# EAGLE schematic UAVpcb (EAGLE 9.6.2)
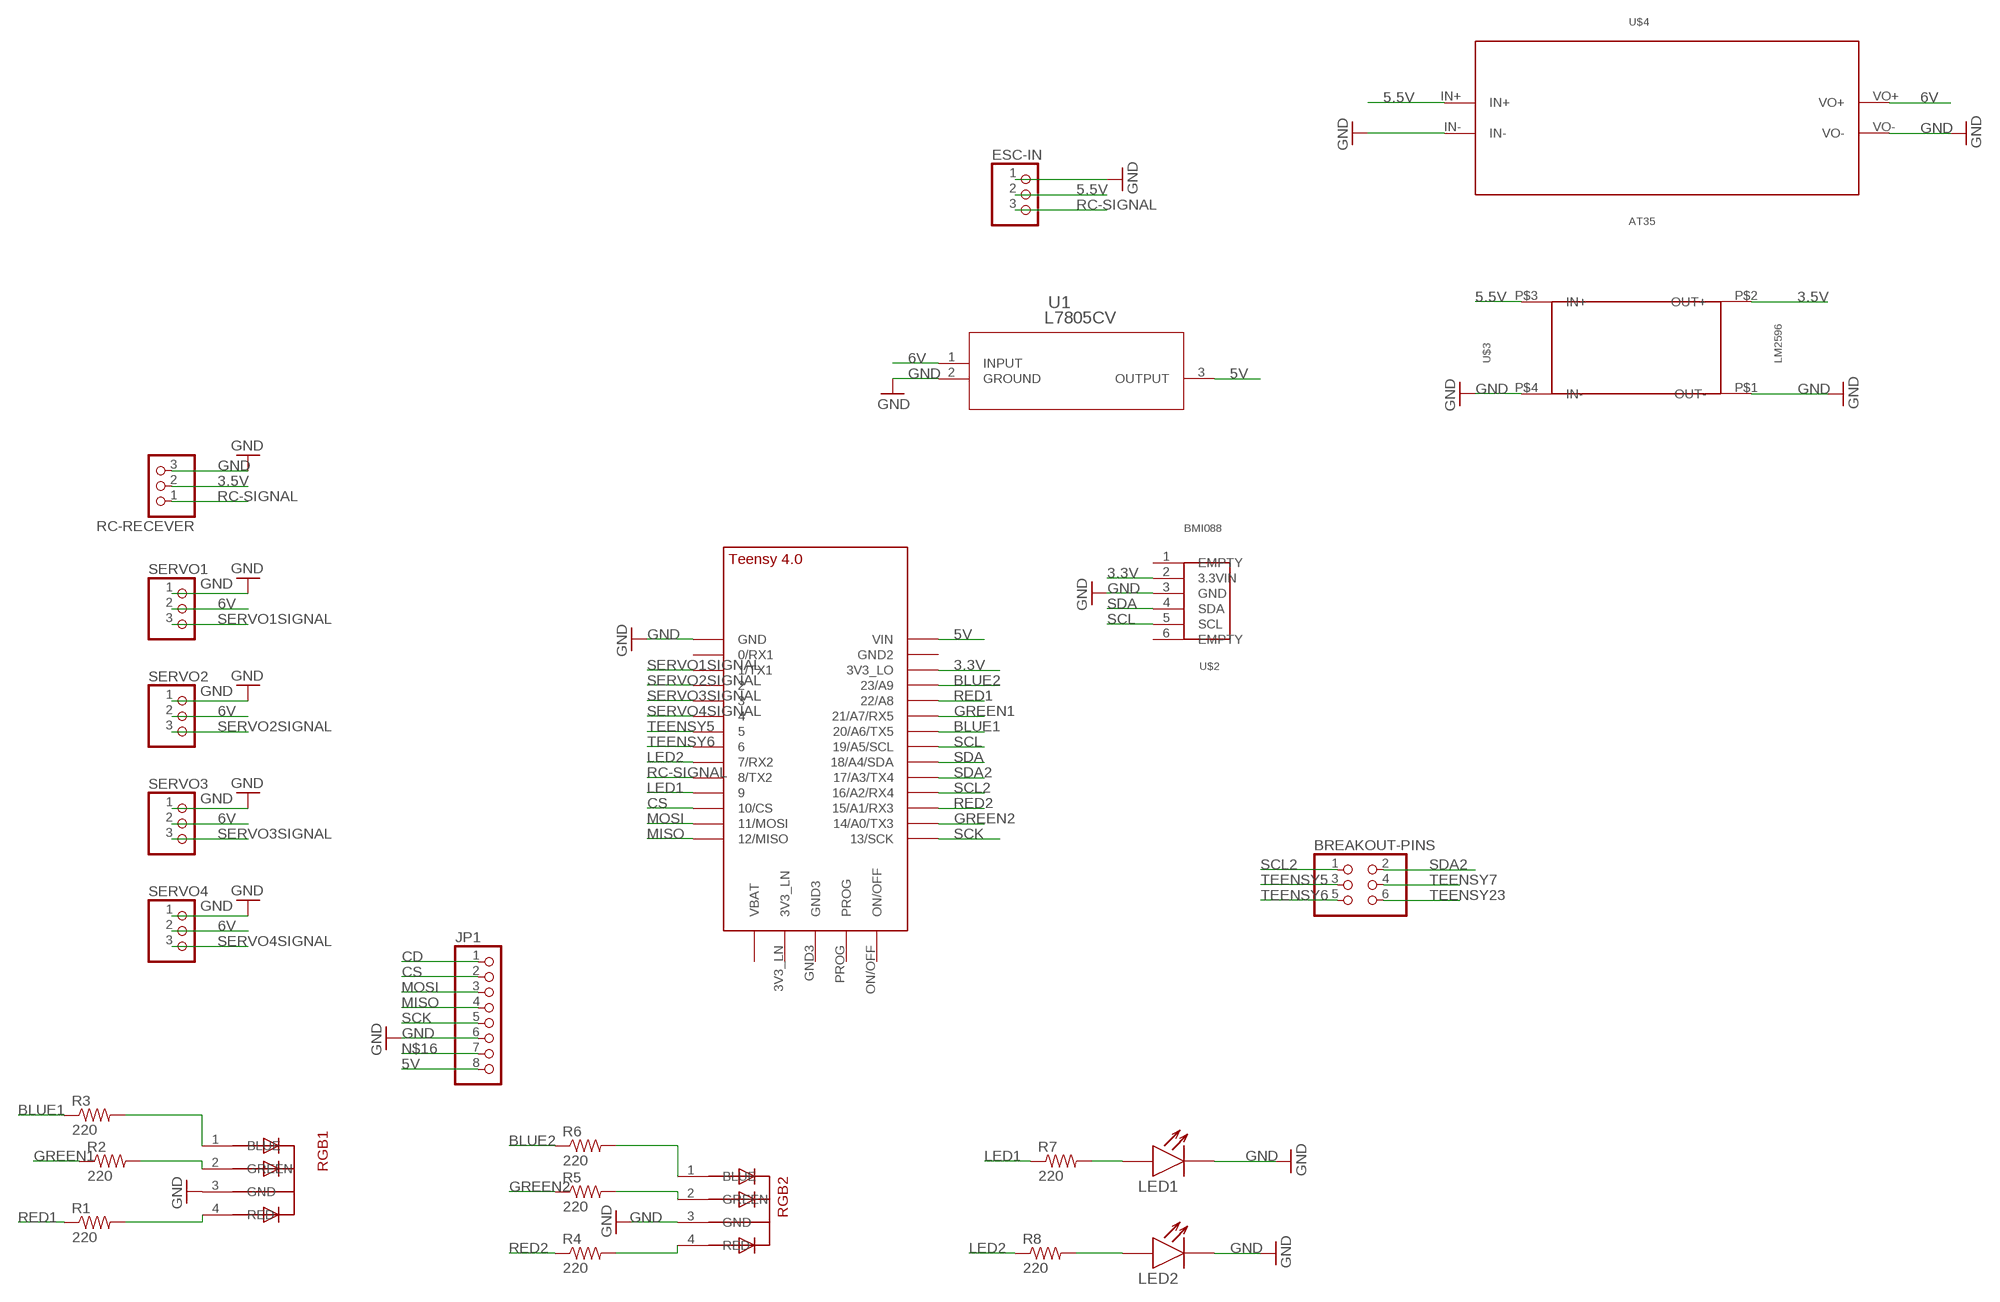
[diagram p0: schematic, sheet 1]

## Parts
BREAKOUT-PINS  PINHD-2X3  [2X03]
ESC-IN  PINHD-1X3  [1X03]
JP1  PINHD-1X8  [1X08]
LED1  LED2P  [JP1]
LED2  LED2P  [JP1]
R1  220  R-US_0207/10  [0207/10]
R2  220  R-US_0207/10  [0207/10]
R3  220  R-US_0207/10  [0207/10]
R4  220  R-US_0207/10  [0207/10]
R5  220  R-US_0207/10  [0207/10]
R6  220  R-US_0207/10  [0207/10]
R7  220  R-US_0207/10  [0207/10]
R8  220  R-US_0207/10  [0207/10]
RC-RECEVER  PINHD-1X3  [1X03]
RGB1  5MMRGBLED  [LED5MMRGB]
RGB2  5MMRGBLED  [LED5MMRGB]
SERVO1  PINHD-1X3/90  [1X03/90]
SERVO2  PINHD-1X3/90  [1X03/90]
SERVO3  PINHD-1X3/90  [1X03/90]
SERVO4  PINHD-1X3/90  [1X03/90]
U1  L7805CV  [TO-220_STM]
U$1  TEENSY_4.0  [TEENSY_4.0]
U$2  BMI088  [1X06]
U$3  LM2596  [LM2596]
U$4  AT35  [AT35]

## Nets
3.3V: U$1.3V3_LO U$2.2(3.3VIN)
3.5V: RC-RECEVER.2 U$3.P$2(OUT+)
5.5V: ESC-IN.2 U$3.P$3(IN+) U$4.IN+
5V: JP1.8 U1.3(OUTPUT) U$1.VIN
6V: SERVO1.2 SERVO2.2 SERVO3.2 SERVO4.2 U1.1(INPUT) U$4.VO+
BLUE1: R3.1 U$1.20/A6(20/A6/TX5)
BLUE2: R6.1 U$1.23/A9
CD: JP1.1
CS: JP1.2 U$1.10/CS
GND: ESC-IN.1 JP1.6 LED1.2(K) LED2.2(K) RC-RECEVER.3 RGB1.3(GND) RGB2.3(GND) SERVO1.1 SERVO2.1 SERVO3.1 SERVO4.1 U1.2(GROUND) U$1.GND U$2.3(GND) U$3.P$1(OUT-) U$3.P$4(IN-) U$4.IN- U$4.VO-
GREEN1: R2.1 U$1.21/A7(21/A7/RX5)
GREEN2: R5.1 U$1.14/A0(14/A0/TX3)
LED1: R7.1 U$1.9/CS
LED2: R8.1 U$1.7(7/RX2)
MISO: JP1.4 U$1.12/MISO
MOSI: JP1.3 U$1.11/MOSI
N$1: LED1.1(A) R7.2
N$2: LED2.1(A) R8.2
N$3: R6.2 RGB2.1(BLUE)
N$4: R5.2 RGB2.2(GREEN)
N$5: R4.2 RGB2.4(RED)
N$6: R3.2 RGB1.1(BLUE)
N$7: R2.2 RGB1.2(GREEN)
N$8: R1.2 RGB1.4(RED)
N$16: JP1.7
RC-SIGNAL: ESC-IN.3 RC-RECEVER.1 U$1.8(8/TX2)
RED1: R1.1 U$1.22/A8
RED2: R4.1 U$1.15/A1(15/A1/RX3)
SCK: JP1.5 U$1.13/SCK
SCL: U$1.19/A5/SCL U$2.5(SCL)
SCL2: BREAKOUT-PINS.1 U$1.16/A2(16/A2/RX4)
SDA: U$1.18/A4/SDA U$2.4(SDA)
SDA2: BREAKOUT-PINS.2 U$1.17/A3(17/A3/TX4)
SERVO1SIGNAL: SERVO1.3 U$1.1/TX(1/TX1)
SERVO2SIGNAL: SERVO2.3 U$1.2
SERVO3SIGNAL: SERVO3.3 U$1.3/CANTX
SERVO4SIGNAL: SERVO4.3 U$1.4/CANRX
TEENSY5: BREAKOUT-PINS.3 U$1.5
TEENSY6: BREAKOUT-PINS.5 U$1.6
TEENSY7: BREAKOUT-PINS.4
TEENSY23: BREAKOUT-PINS.6
Unconnected: U$1.0/RX(0/RX1) U$1.3V3_LN U$1.GND2 U$1.GND3 U$1.ON/OFF U$1.PROG U$1.VBAT\(VBAT) U$2.1(EMPTY) U$2.6(EMPTY)

## Library data of the parts
BREAKOUT-PINS = pinhead:PINHD-2X3: PIN HEADER
ESC-IN RC-RECEVER SERVO1-SERVO4 = pinhead:PINHD-1X3: PIN HEADER
JP1 = pinhead:PINHD-1X8: PIN HEADER
LED1 LED2 = OPTO:LED2P
R1-R8 = rcl:R-US_: RESISTOR, American symbol; SPICEPREFIX: R
RGB1 RGB2 = adafruit:5MMRGBLED
U1 = L7805CV:L7805CV; BUILT_BY: EMA_UL_Team; MANUFACTURER_PART_NUMBER: L7805CV; SOURCELIBRARY: Updates_to_database_2020-11-10; VENDOR: STMicroelectronics
U$1 = TEENSY 4.0:TEENSY_4.0
U$2 = BMI088:BMI088
U$3 = LM2596:LM2596
U$4 = at35:AT35